# Altium schematic sheet Car Power Supply 2x Line v1.0.SchDoc: ComponentName
size A4; SheetNumber: 1; SheetTotal: 1; Version: ver; Variant: Variant; Modification: Mod; Project: Project Name
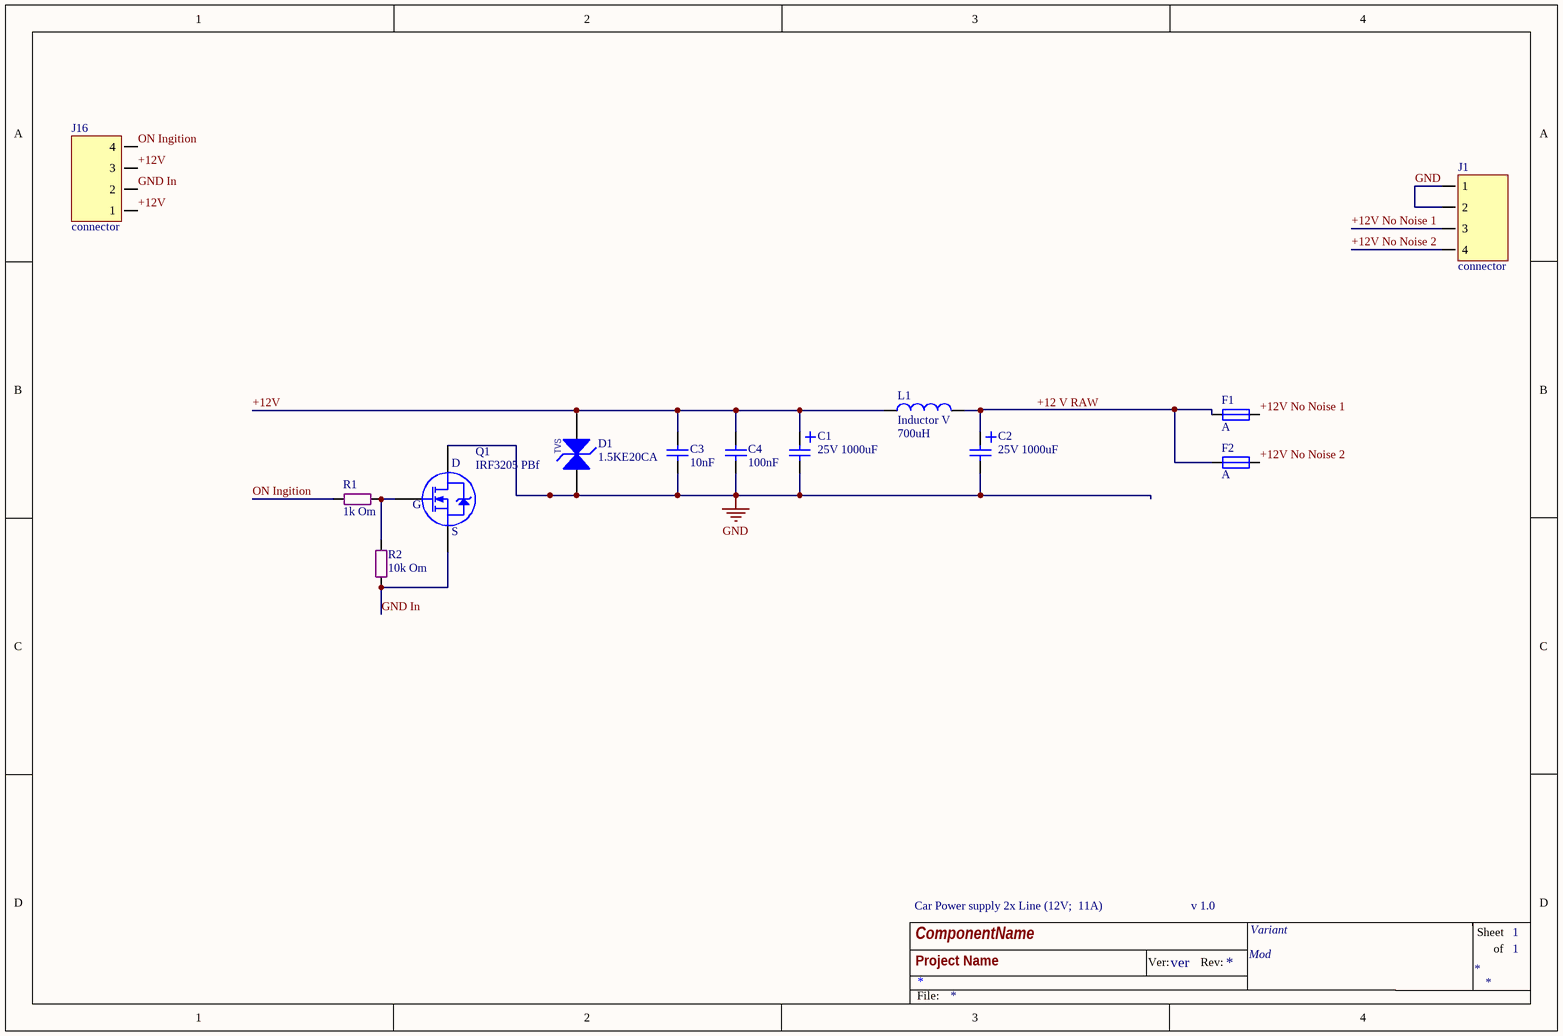
[diagram p0: Car Power Supply 2x Line v1.0.SchDoc]

## Parts
C1  25V 1000uF  [Cap E p5.08mm D10.2mm (3p)]
C2  25V 1000uF  [Cap E p5.08mm D10.2mm (3p)]
C3  10nF  [SMD 1206 (3216)]
C4  100nF  [SMD 1206 (3216)]
D1  1.5KE20CA  [TVS diode DO-201 V]
F1  A  [Fuse RGE1100]
F2  A  [Fuse RGE1100]
J1  connector  [Molex Mini-Fit Jr - 4Pin V]
J16  connector  [Molex Mini-Fit Jr - 4Pin V]
L1  Inductor V  value 700uH  [Toroid V D14-W6]
Q1  IRF3205 PBf  [TO220-2 HighPower]
R1  1k Om  [SMD 0805 (2012)]
R2  10k Om  [SMD 0805 (2012)]

## Nets
GND: C1.2 C2.2 C3.2 C4.2 D1.1 J1.1 J1.2 Q1.2(D)
+12V: C1.1 C3.1 C4.1 D1.2 J16.1 J16.3 L1.1
+12V No Noise 1: F1.2 J1.3
+12V No Noise 2: F2.2 J1.4
GND In: J16.2 Q1.3(S) R2.1
ON Ingition: J16.4 R1.1
NetC2_1: C2.1 F1.1 F2.1 L1.2
NetQ1_1: Q1.1(G) R1.2 R2.2

## Notes on the sheet
- Car Power supply 2x Line (12V;  11A)
- v 1.0
- Labels drawn without touching a wire or pin: +12 V RAW
- Ver:
- Rev:
- Sheet
- of
- File:
- (in symbol TVS 1.5KE20CA) TVS

## Library data of the parts
C1 C2 = Cap E 1000mF x 25V: Capacitor
C3 C4 = Cap Ceramic SMD (All): Capacitor
D1 = TVS 1.5KE20CA: 1500W Transil (TVS Diode); Stand-Off V: 17.1; Load A: 5; Breakdown V: min 19 max 21; PackageReference: DO-201; Pulse Power: 1500W; VALUE: 1.5KE20CA
F1 F2 = Fuse: Round fuse
J1 J16 = Molex Mini-Fit Jr - 4 pin: Right, Dbl line, Female
L1 = Inductor V: Inductor Vertical; Code_IEC: 1005; Published: 8-Jun-2000; LatestRevisionDate: 29-May-2009; LatestRevisionNote: IPC-7351 Footprint Added.; PackageReference: 0402-A; Publisher: Altium Limited; PackageDescription: Chip Inductor; Code_JEITA: 0402
Q1 = IRF3205: N-Channel 55V - 0.008Ω - 110A; Monufacturer: IOR; RDS Сопротивление Сток-Исток: 0.008 Om; I d - Drain current (continuous) at TC = 100°C: 80 A; VGS Порог Открытия: +2....+4 V; VGS Макс напр на гейте: +-20 V; C ISS Входная емкость: 3247 pF; C OSS Выходная емкость: 781 pF; V DSS (v): 55V; I d - Drain current (continuous) at TC = 25°C: 110 A; Name: IRF3205 PBf; Datasheet: http://tec.org.ru/_bd/2/223_IRF3205.pdf; URL: http://tec.org.ru/board/49-1-0-223
R1 R2 = Res All Types